# EAGLE schematic midi2cv.v2 (EAGLE 6.5.0)
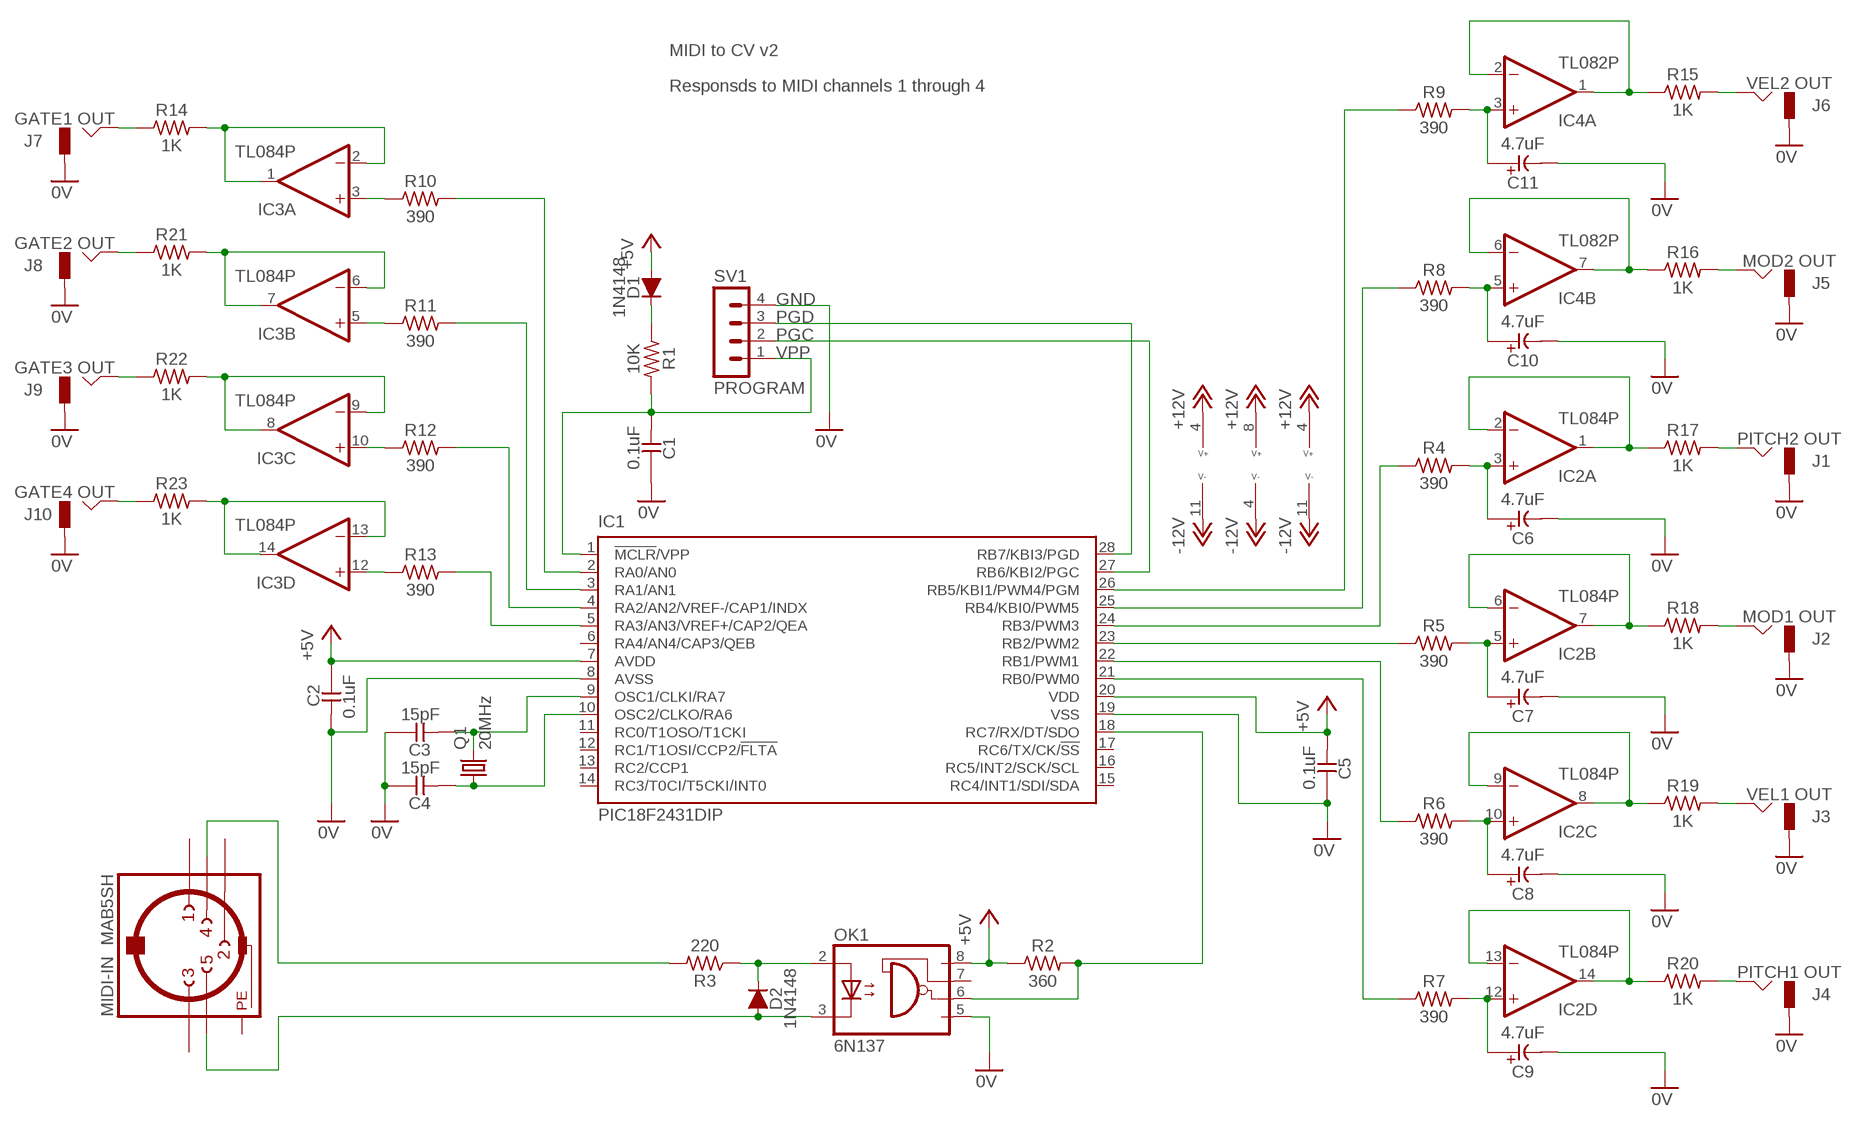
[diagram p0: schematic, sheet 1]

## Parts
C1  0.1uF  CC-US025-024X044  [C025-024X044]
C2  0.1uF  CC-US025-024X044  [C025-024X044]
C3  15pF  CC-US025-024X044  [C025-024X044]
C4  15pF  CC-US025-024X044  [C025-024X044]
C5  0.1uF  CC-US025-024X044  [C025-024X044]
C6  4.7uF  CE-USE2-5  [E2-5]
C7  4.7uF  CE-USE2-5  [E2-5]
C8  4.7uF  CE-USE2-5  [E2-5]
C9  4.7uF  CE-USE2-5  [E2-5]
C10  4.7uF  CE-USE2-5  [E2-5]
C11  4.7uF  CE-USE2-5  [E2-5]
D1  1N4148  [DO35-7]
D2  1N4148  [DO35-7]
IC1  PIC18F2431DIP  [DIL28-3]
IC2  TL084P  [DIL14]
IC3  TL084P  [DIL14]
IC4  TL082P  [DIL08]
J1  PITCH2 OUT  JACK-M  [JACK-M]
J2  MOD1 OUT  JACK-M  [JACK-M]
J3  VEL1 OUT  JACK-M  [JACK-M]
J4  PITCH1 OUT  JACK-M  [JACK-M]
J5  MOD2 OUT  JACK-M  [JACK-M]
J6  VEL2 OUT  JACK-M  [JACK-M]
J7  GATE1 OUT  JACK-M  [JACK-M]
J8  GATE2 OUT  JACK-M  [JACK-M]
J9  GATE3 OUT  JACK-M  [JACK-M]
J10  GATE4 OUT  JACK-M  [JACK-M]
MIDI-IN  MAB5SH  [MAB5SH]
OK1  6N137  [DIL08]
Q1  20MHz  CRYSTALHC49S  [HC49/S]
R1  10K  R0309/10  [0309/10]
R2  360  R0309/10  [0309/10]
R3  220  R0309/10  [0309/10]
R4  390  R0309/10  [0309/10]
R5  390  R0309/10  [0309/10]
R6  390  R0309/10  [0309/10]
R7  390  R0309/10  [0309/10]
R8  390  R0309/10  [0309/10]
R9  390  R0309/10  [0309/10]
R10  390  R0309/10  [0309/10]
R11  390  R0309/10  [0309/10]
R12  390  R0309/10  [0309/10]
R13  390  R0309/10  [0309/10]
R14  1K  R0309/10  [0309/10]
R15  1K  R0309/10  [0309/10]
R16  1K  R0309/10  [0309/10]
R17  1K  R0309/10  [0309/10]
R18  1K  R0309/10  [0309/10]
R19  1K  R0309/10  [0309/10]
R20  1K  R0309/10  [0309/10]
R21  1K  R0309/10  [0309/10]
R22  1K  R0309/10  [0309/10]
R23  1K  R0309/10  [0309/10]
SV1  PROGRAM  MA04-1  [MA04-1]

## Nets
0V: C1.1 C2.2 C3.1 C4.1 C5.1 C6.- C7.- C8.- C9.- C10.- C11.- IC1.8(AVSS) IC1.19(VSS) J1.GND J2.GND J3.GND J4.GND J5.GND J6.GND J7.GND J8.GND J9.GND J10.GND OK1.5(GND)
+5V: C2.1 C5.2 D1.A IC1.7(AVDD) IC1.20(VDD) OK1.8(VCC) R2.1
+12V: IC2.4(P:V+) IC3.4(P:V+) IC4.8(P:V+)
-12V: IC2.11(P:V-) IC3.11(P:V-) IC4.4(P:V-)
GND: SV1.4 ; supply symbol labelled 0V
N$1: D1.C R1.1
N$2: IC2.1(A:OUT) IC2.2(A:-IN) R17.1
N$3: IC2.6(B:-IN) IC2.7(B:OUT) R18.1
N$4: IC2.8(C:OUT) IC2.9(C:-IN) R19.1
N$5: IC3.5(B:+IN) R11.1
N$6: C4.2 Q1.1
N$7: IC2.13(D:-IN) IC2.14(D:OUT) R20.1
N$8: C6.+ IC2.3(A:+IN) R4.2
N$9: MIDI-IN.4 R3.2
N$10: D2.A MIDI-IN.5 OK1.3(C)
N$11: D2.C OK1.2(A) R3.1
N$12: C7.+ IC2.5(B:+IN) R5.2
N$13: OK1.6(VO) R2.2
N$14: C8.+ IC2.10(C:+IN) R6.2
N$15: C9.+ IC2.12(D:+IN) R7.2
N$16: IC1.24(RB3/PWM3) R4.1
N$17: IC1.23(RB2/PWM2) R5.1
N$18: IC1.22(RB1/PWM1) R6.1
N$19: IC1.21(RB0/PWM0) R7.1
N$20: IC1.25(RB4/KBI0/PWM5) R8.1
N$21: IC1.26(RB5/KBI1/PWM4/PGM) R9.1
N$22: IC4.1(A:OUT) IC4.2(A:-IN) R15.1
N$23: IC4.6(B:-IN) IC4.7(B:OUT) R16.1
N$24: C11.+ IC4.3(A:+IN) R9.2
N$25: C10.+ IC4.5(B:+IN) R8.2
N$26: IC1.2(RA0/AN0) R10.2
N$27: C3.2 IC1.9(OSC1/CLKI/RA7) Q1.2
N$28: IC1.3(RA1/AN1) R11.2
N$29: IC1.4(RA2/AN2/VREF-/CAP1/INDX) R12.2
N$30: IC1.5(RA3/AN3/VREF+/CAP2/QEA) R13.2
N$31: IC3.13(D:-IN) IC3.14(D:OUT) R23.2
N$32: IC3.12(D:+IN) R13.1
N$33: IC3.10(C:+IN) R12.1
N$34: IC3.3(A:+IN) R10.1
N$35: IC3.8(C:OUT) IC3.9(C:-IN) R22.2
N$36: IC3.6(B:-IN) IC3.7(B:OUT) R21.2
N$37: IC3.1(A:OUT) IC3.2(A:-IN) R14.2
N$38: J7.HOT R14.1
N$39: J8.HOT R21.1
N$40: J9.HOT R22.1
N$41: J10.HOT R23.1
N$42: J6.HOT R15.2
N$43: J5.HOT R16.2
N$44: J1.HOT R17.2
N$45: J2.HOT R18.2
N$46: J3.HOT R19.2
N$47: J4.HOT R20.2
PGC: SV1.2
PGD: IC1.28(RB7/KBI3/PGD) SV1.3
VPP: C1.2 IC1.1(!MCLR!/VPP) R1.2 SV1.1
Unconnected: IC1.6(RA4/AN4/CAP3/QEB) IC1.10(OSC2/CLKO/RA6) IC1.11(RC0/T1OSO/T1CKI) IC1.12(RC1/T1OSI/CCP2/!FLTA) IC1.13(RC2/CCP1) IC1.14(RC3/T0CI/T5CKI/INT0) IC1.15(RC4/INT1/SDI/SDA) IC1.16(RC5/INT2/SCK/SCL) IC1.17(RC6/TX/CK/!SS) IC1.18(RC7/RX/DT/SDO) IC1.27(RB6/KBI2/PGC) MIDI-IN.1 MIDI-IN.2 MIDI-IN.3 OK1.7(VE)

## Notes on the sheet
- MIDI to CV v2
- Responsds to MIDI channels 1 through 4

## Power pins joined to a net without a drawn wire
PE: MIDI-IN.PE MIDI-IN.PE@(PE)

## Library data of the parts
C1-C5 = _common:CC-US: CAPACITOR, US symbol
C6-C11 = _common:CE-US: ELECTROLYTIC CAPACITOR, US symbol
D1 D2 = _common:1N4148: DIODE high speed (Philips)
IC1 = _common:PIC18F2*31: USB Microcontrollers with nanoWatt Technology High-Performance, Enhanced Flash, 28-Pin, Source: http://ww1.microchip.com/downloads/en/devicedoc/39616d.pdf; MF: MICROCHIP; MPN: PIC18F2431-I/SP
IC2 IC3 = _common:TL084: OP AMP
IC4 = _common:TL082: OP AMP
J1-J10 = _common:JACK-M
MIDI-IN = con-hirschmann:MAB5SH: Female CONNECTOR 5 pins 90 deg. with shield, horizontal (DIN 41524); OC_FARNELL: 809883; OC_NEWARK: unknown
OK1 = optocoupler:6N137: MOTOROLA OPTO COUPLER; MPN: 6N137; OC_FARNELL: 1328376; OC_NEWARK: 52M1895
Q1 = crystal:CRYSTAL: CRYSTAL; OC_FARNELL: 1667008; OC_NEWARK: unknown
R1-R23 = _common:R: RESISTOR, US symbol
SV1 = con-lstb:MA04-1: PIN HEADER; OC_FARNELL: unknown; OC_NEWARK: unknown